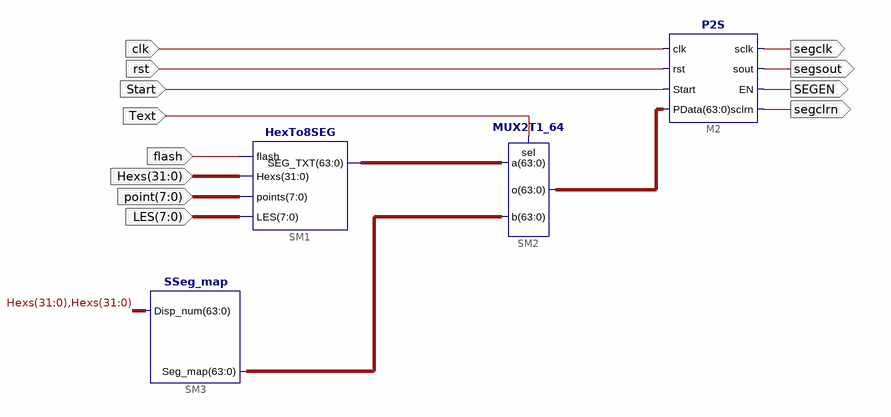
[diagram p0: schematic sheet 1]
// Xilinx ISE schematic Display.sch (kintex7) as structural Verilog: 4 symbols, 12 ports
module Display (
  input  clk,
  input  rst,
  input  Start,
  input  Text,
  input  flash,
  input  [31:0] Hexs,
  input  [7:0] point,
  input  [7:0] LES,
  output segclk,
  output segsout,
  output SEGEN,
  output segclrn
);

  wire [63:0] XLXN_10, XLXN_12, XLXN_14;

  HexTo8SEG SM1 (.LES(LES), .points(point), .Hexs(Hexs), .SEG_TXT(XLXN_14), .flash(flash));
  SSeg_map SM3 (.Disp_num({Hexs, Hexs}), .Seg_map(XLXN_12));
  MUX2T1_64 SM2 (.b(XLXN_12), .sel(Text), .a(XLXN_14), .o(XLXN_10));
  P2S M2 (
    .sclrn(segclrn), .sout(segsout), .rst(rst), .EN(SEGEN), .Start(Start), .clk(clk), .sclk(segclk),
    .PData(XLXN_10));
endmodule
